# EAGLE schematic BeVimExpansionBoard (EAGLE 7.3.0)
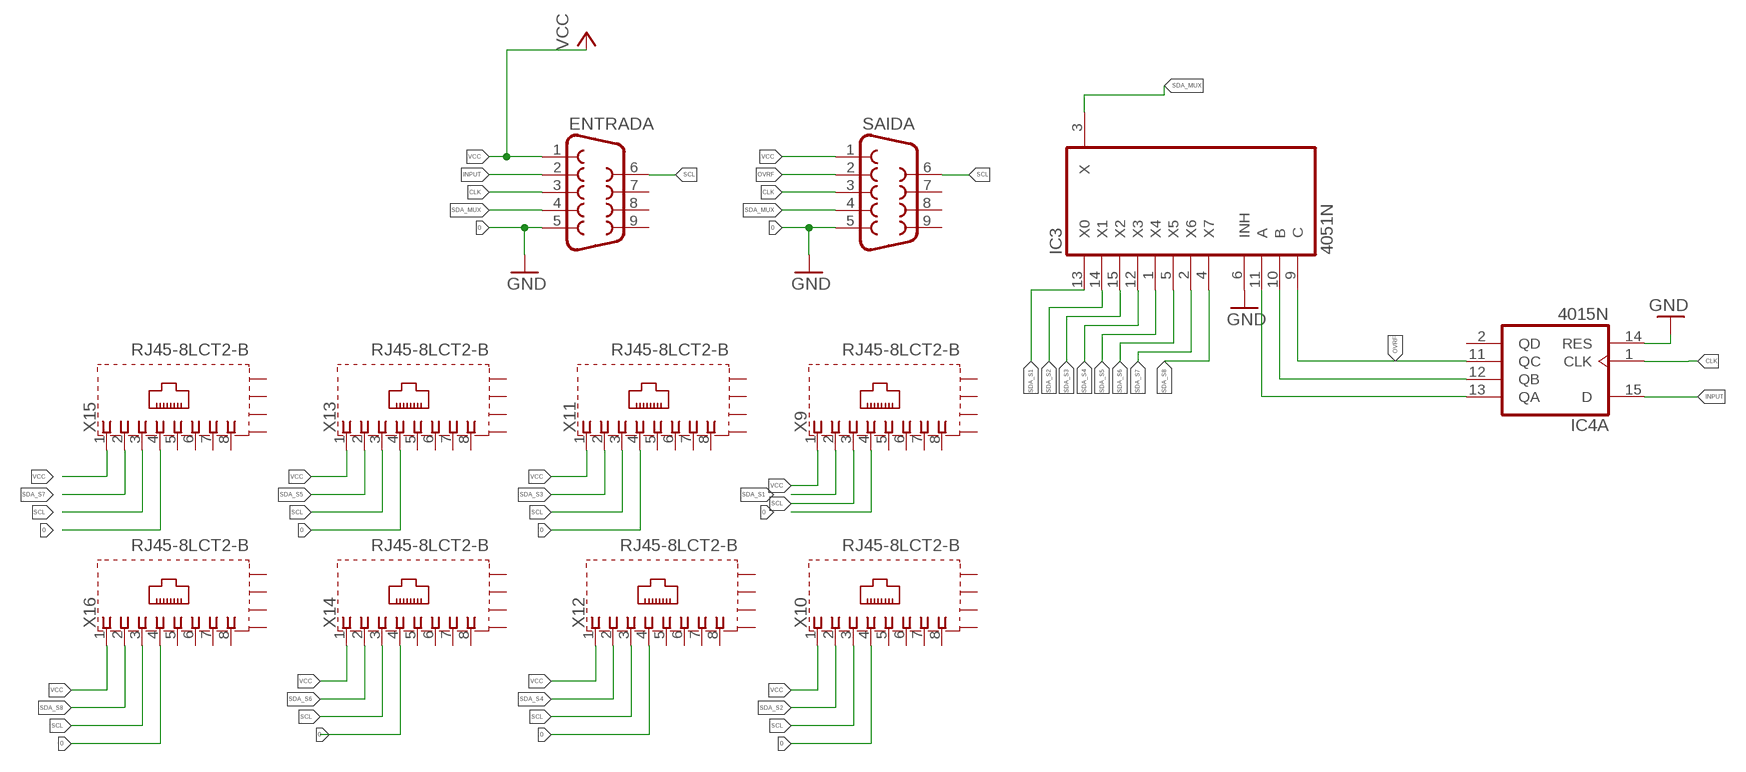
[diagram p0: schematic, sheet 1]

## Parts
ENTRADA  DB9FEMALE  [DB9]
IC3  4051N  [DIL16]
IC4  4015N  [DIL16]
SAIDA  DB9FEMALE  [DB9]
X9  RJ45-8LCT2-B  [RJ45-SHIELD2]
X10  RJ45-8LCT2-B  [RJ45-SHIELD2]
X11  RJ45-8LCT2-B  [RJ45-SHIELD2]
X12  RJ45-8LCT2-B  [RJ45-SHIELD2]
X13  RJ45-8LCT2-B  [RJ45-SHIELD2]
X14  RJ45-8LCT2-B  [RJ45-SHIELD2]
X15  RJ45-8LCT2-B  [RJ45-SHIELD2]
X16  RJ45-8LCT2-B  [RJ45-SHIELD2]

## Nets
0: ENTRADA.5 IC3.6(INH) IC4.14(A:RES) SAIDA.5 X9.4 X10.4 X11.4 X12.4 X13.4 X14.4 X15.4 X16.4
CLK: ENTRADA.3 IC4.1(A:CLK) SAIDA.3
INPUT: ENTRADA.2 IC4.15(A:D)
N$1: IC3.11(A) IC4.13(A:QA)
N$2: IC3.10(B) IC4.12(A:QB)
OVRF: IC3.9(C) IC4.11(A:QC) SAIDA.2
SCL: ENTRADA.6 SAIDA.6 X9.3 X10.3 X11.3 X12.3 X13.3 X14.3 X15.3 X16.3
SDA_MUX: ENTRADA.4 IC3.3(X) SAIDA.4
SDA_S1: IC3.13(X0) X9.2
SDA_S2: IC3.14(X1) X10.2
SDA_S3: IC3.15(X2) X11.2
SDA_S4: IC3.12(X3) X12.2
SDA_S5: IC3.1(X4) X13.2
SDA_S6: IC3.5(X5) X14.2
SDA_S7: IC3.2(X6) X15.2
SDA_S8: IC3.4(X7) X16.2
VCC: ENTRADA.1 SAIDA.1 X9.1 X10.1 X11.1 X12.1 X13.1 X14.1 X15.1 X16.1
Unconnected: ENTRADA.7 ENTRADA.8 ENTRADA.9 IC4.2(A:QD) IC4.3(B:QC) IC4.4(B:QB) IC4.5(B:QA) IC4.6(B:RES) IC4.7(B:D) IC4.9(B:CLK) IC4.10(B:QD) SAIDA.7 SAIDA.8 SAIDA.9 X9.5 X9.6 X9.7 X9.8 X9.S1(S) X9.S2(S) X9.S3(S) X9.S4(S) X10.5 X10.6 X10.7 X10.8 X10.S1(S) X10.S2(S) X10.S3(S) X10.S4(S) X11.5 X11.6 X11.7 X11.8 X11.S1(S) X11.S2(S) X11.S3(S) X11.S4(S) X12.5 X12.6 X12.7 X12.8 X12.S1(S) X12.S2(S) X12.S3(S) X12.S4(S) X13.5 X13.6 X13.7 X13.8 X13.S1(S) X13.S2(S) X13.S3(S) X13.S4(S) X14.5 X14.6 X14.7 X14.8 X14.S1(S) X14.S2(S) X14.S3(S) X14.S4(S) X15.5 X15.6 X15.7 X15.8 X15.S1(S) X15.S2(S) X15.S3(S) X15.S4(S) X16.5 X16.6 X16.7 X16.8 X16.S1(S) X16.S2(S) X16.S3(S) X16.S4(S)

## Power pins joined to a net without a drawn wire
GND: IC3.8(GND)
VCC: IC3.16(VCC)
VDD: IC4.16(P:VDD)
VEE: IC3.7(VEE)
VSS: IC4.8(P:VSS)

## Library data of the parts
ENTRADA SAIDA = SparkFun-Connectors:DB9: DB9 Connector Standard DB9 (D-Sub 9) serial connector. Can be used for CAN bus as well as RS485 and RS232. Footprint production proven. Spark Fun Electronics SKU : PRT-00429; PROD_ID: CONN-08194
IC3 = 40xx:4051: 8-channel ANALOG MULTIPLEXER
IC4 = 40xx:4015: Dual 4-bit static SHIFT REGISTER
X9-X16 = con-tycoelectronics:RJ45*2: RJ45 Low Profile Shield Type 2 For all RJ45 L, LC, LCT and X Series Models Source: www.tycoelectronics.com .. ENG_DS_1654001_1099_RJ_L_0507.pdf; MF: TYCO ELECTRONICS; MPN: RJ45-8LCT2-B; OC_FARNELL: unknown; OC_NEWARK: 91F7263